# Altium project BLDC Motor Controller.PrjPcb
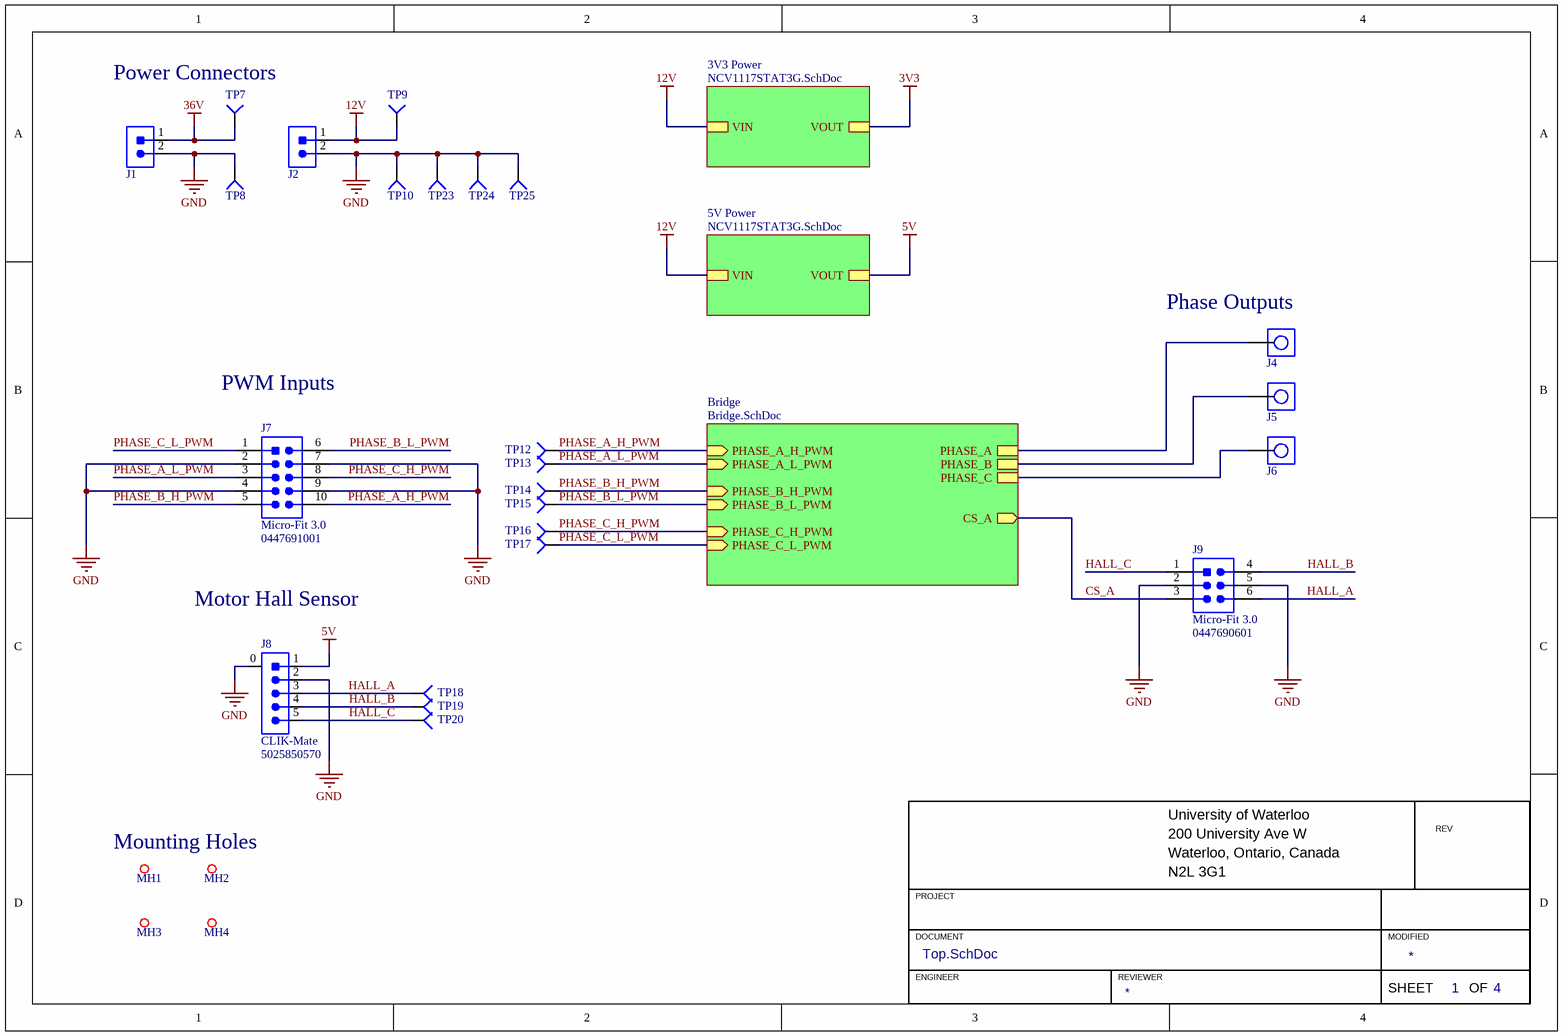
[diagram p0: Top.SchDoc]
4 sheets, 80 parts. Net scope: hierarchical (ports join the sheet entries above them; power ports are global).
Board file: BLDC Motor Controller.PcbDoc
Sheets:
  Top.SchDoc
    Bridge = Bridge.SchDoc
      Phase A CS = INA190.SchDoc
    3V3 Power = NCV1117STAT3G.SchDoc
    5V Power = NCV1117STAT3G.SchDoc

## Sheet Top.SchDoc
size A4; Organization: TESLA Motors, INC; Address1: 3500 Deer Creek Road; Address2: Palo Alto, CA; Address4: U.S.A.; SheetNumber: 1; SheetTotal: 4

### Parts
J1  CON_2POS_XT90  [XT90]  (value not drawn)
J2  CON_2POS_XT60  [XT60]  (value not drawn)
J4  CT3151SP-4  [CALTEST_BANANA_JACK_YELLOW]  (value not drawn)
J5  CT3151SP-5  [CALTEST_BANANA_JACK_GREEN]  (value not drawn)
J6  CT3151SP-6  [CALTEST_BANANA_JACK_BLUE]  (value not drawn)
J7  Family: Micro-Fit 3.0  [MOLEX-0447691001]  (hidden comment: 0447691001)
J8  Family: CLIK-Mate  Manufacturer Part Number 1: 5025850570  [MOLEX-5025850570]  (hidden comment: CON_5M_SM_RA)
J9  Family: Micro-Fit 3.0  [MOLEX-0447690601]  (hidden comment: 0447690601)
MH1  MOUNTING_HOLE_M3  [MOUNTING_HOLE_3mm]  (value not drawn)  (no BOM)
MH2  MOUNTING_HOLE_M3  [MOUNTING_HOLE_3mm]  (value not drawn)  (no BOM)
MH3  MOUNTING_HOLE_M3  [MOUNTING_HOLE_3mm]  (value not drawn)  (no BOM)
MH4  MOUNTING_HOLE_M3  [MOUNTING_HOLE_3mm]  (value not drawn)  (no BOM)
TP7  TESTPOINT_SMD_LOOP  [S1751-46R]  (value not drawn)
TP8  TESTPOINT_SMD_LOOP  [S1751-46R]  (value not drawn)
TP9  TESTPOINT_SMD_LOOP  [S1751-46R]  (value not drawn)
TP10  TESTPOINT_SMD_LOOP  [S1751-46R]  (value not drawn)
TP12  TESTPOINT_1MM_CIRCLE  [TESTPOINT_CIRCLE_1MM]  (value not drawn)  (no BOM)
TP13  TESTPOINT_1MM_CIRCLE  [TESTPOINT_CIRCLE_1MM]  (value not drawn)  (no BOM)
TP14  TESTPOINT_1MM_CIRCLE  [TESTPOINT_CIRCLE_1MM]  (value not drawn)  (no BOM)
TP15  TESTPOINT_1MM_CIRCLE  [TESTPOINT_CIRCLE_1MM]  (value not drawn)  (no BOM)
TP16  TESTPOINT_1MM_CIRCLE  [TESTPOINT_CIRCLE_1MM]  (value not drawn)  (no BOM)
TP17  TESTPOINT_1MM_CIRCLE  [TESTPOINT_CIRCLE_1MM]  (value not drawn)  (no BOM)
TP18  TESTPOINT_1MM_CIRCLE  [TESTPOINT_CIRCLE_1MM]  (value not drawn)  (no BOM)
TP19  TESTPOINT_1MM_CIRCLE  [TESTPOINT_CIRCLE_1MM]  (value not drawn)  (no BOM)
TP20  TESTPOINT_1MM_CIRCLE  [TESTPOINT_CIRCLE_1MM]  (value not drawn)  (no BOM)
TP23  TESTPOINT_SMD_LOOP  [S1751-46R]  (value not drawn)
TP24  TESTPOINT_SMD_LOOP  [S1751-46R]  (value not drawn)
TP25  TESTPOINT_SMD_LOOP  [S1751-46R]  (value not drawn)

### Sub-sheets
3V3 Power = NCV1117STAT3G.SchDoc: VIN, VOUT
5V Power = NCV1117STAT3G.SchDoc: VIN, VOUT
Bridge = Bridge.SchDoc: PHASE_A_H_PWM (in), PHASE_A_L_PWM (in), PHASE_B_H_PWM (in), PHASE_B_L_PWM (in), PHASE_C_H_PWM (in), PHASE_C_L_PWM (in), CS_A (out), PHASE_A, PHASE_B, PHASE_C

### Nets
5V: J8.1 ; sheet 5V Power/VOUT
12V: J2.1 TP9.1(=value) ; sheet 3V3 Power/VIN, sheet 5V Power/VIN
36V: J1.1 TP7.1(=value)
GND: J1.2 J2.2 J7.2 J7.4 J7.7 J7.9 J8.0 J8.2 J9.2 J9.5 TP8.1(=value) TP10.1(=value) TP23.1(=value) TP24.1(=value) TP25.1(=value)
CS_A: J9.3 ; sheet Bridge/CS_A
HALL_A: J8.3 J9.6 TP18.1(=value)
HALL_B: J8.4 J9.4 TP19.1(=value)
HALL_C: J8.5 J9.1 TP20.1(=value)
PHASE_A: J4.1 ; sheet Bridge/PHASE_A
PHASE_A_H_PWM: J7.10 TP12.1(=value) ; sheet Bridge/PHASE_A_H_PWM
PHASE_A_L_PWM: J7.3 TP13.1(=value) ; sheet Bridge/PHASE_A_L_PWM
PHASE_B: J5.1 ; sheet Bridge/PHASE_B
PHASE_B_H_PWM: J7.5 TP14.1(=value) ; sheet Bridge/PHASE_B_H_PWM
PHASE_B_L_PWM: J7.6 TP15.1(=value) ; sheet Bridge/PHASE_B_L_PWM
PHASE_C: J6.1 ; sheet Bridge/PHASE_C
PHASE_C_H_PWM: J7.8 TP16.1(=value) ; sheet Bridge/PHASE_C_H_PWM
PHASE_C_L_PWM: J7.1 TP17.1(=value) ; sheet Bridge/PHASE_C_L_PWM

### Notes on the sheet
- (near TP7) Power Connectors
- (near J4) Phase Outputs
- PWM Inputs
- Motor Hall Sensor
- Mounting Holes
- University of Waterloo
- 200 University Ave W
- REV
- PROJECT
- Waterloo, Ontario, Canada
- N2L 3G1
- DOCUMENT
- ENGINEER
- REVIEWER
- MODIFIED
- SHEET
- OF

### Library data of the parts
J1 = CON_2POS_XT90: XT60 CONNECTORS MALE/FEMALE PAIR; Manufacturer 1: DFRobot; Manufacturer Part Number 1: FIT0588; Mounting Type: TH; Package/Footprint: XT90; Supplier 1: Digi-Key; Supplier Part Number 1: 1738-1438-ND
J2 = CON_2POS_XT60: XT60 CONNECTORS MALE/FEMALE PAIR; Manufacturer 1: SparkFun Electronics; Manufacturer Part Number 1: PRT-10474; Mounting Type: TH; Package/Footprint: XT60; Supplier 1: Digi-Key; Supplier Part Number 1: 1568-1816-ND
J4 = CON_BANANA_YELLOW_25A: CONN BANANA JACK SOLDER YELLOW; Manufacturer 1: Cal Test Electronics; Current Rating: 25A; Manufacturer Part Number 1: CT3151SP-4; Supplier 1: Digi-Key; Supplier Part Number 1: BKCT3151SP-4-ND
J5 = CON_BANANA_GREEN_25A: CONN BANANA JACK SOLDER GREEN; Manufacturer 1: Cal Test Electronics; Current Rating: 25A; Manufacturer Part Number 1: CT3151SP-5; Supplier 1: Digi-Key; Supplier Part Number 1: BKCT3151SP-5-ND
J6 = CON_BANANA_BLUE_25A: CONN BANANA JACK SOLDER BLUE; Manufacturer 1: Cal Test Electronics; Current Rating: 25A; Manufacturer Part Number 1: CT3151SP-6; Supplier 1: Digi-Key; Supplier Part Number 1: BKCT3151SP-6-ND
J7 = CON_MOLEX-RCPT_5x2_TH: CONN RCPT 10POS 0.118 TIN PCB; Manufacturer 1: Molex; Voltage Rating: 250VAC; Current Rating: 5A; Pitch: 3mm; Supplier 1: Digi-Key; Supplier Part Number 1: WM1956-ND; Manufacturer Part Number 1: 0447691001
J8 = CON_5M_SM_RA: CONN HEADER SMD RIGHT ANGLE 1.5MM PITCH; Manufacturer 1: Molex; Current Rating: 2A; Supplier 1: Digi-Key; Mounting Type: SMD; Orientation: Right Angle; Supplier Part Number 1: WM14469CT-ND; Package/Footprint: SMD
J9 = CON_MOLEX-RCPT_3x2_TH: CONN RCPT 6POS 0.118 TIN PCB; Manufacturer 1: Molex; Voltage Rating: 250VAC; Current Rating: 5A; Pitch: 3mm; Supplier 1: Digi-Key; Supplier Part Number 1: 23-0447690601-ND; Manufacturer Part Number 1: 0447690601
TP7-TP10 TP23-TP25 = TESTPOINT_SMD_LOOP: TESTPOINT SMD LOOP; Manufacturer 1: Harwin; Supplier 1: Digi-Key; Manufacturer Part Number 1: S1751-46R; Mounting Type: SMD; Package/Footprint: SMD; Supplier Part Number 1: 952-1478-1-ND
TP12-TP20 = TESTPOINT_1MM_CIRCLE: TESTPOINT 1MM CIRCLE

## Sheet Bridge.SchDoc
size A4; SheetNumber: 2; SheetTotal: 4
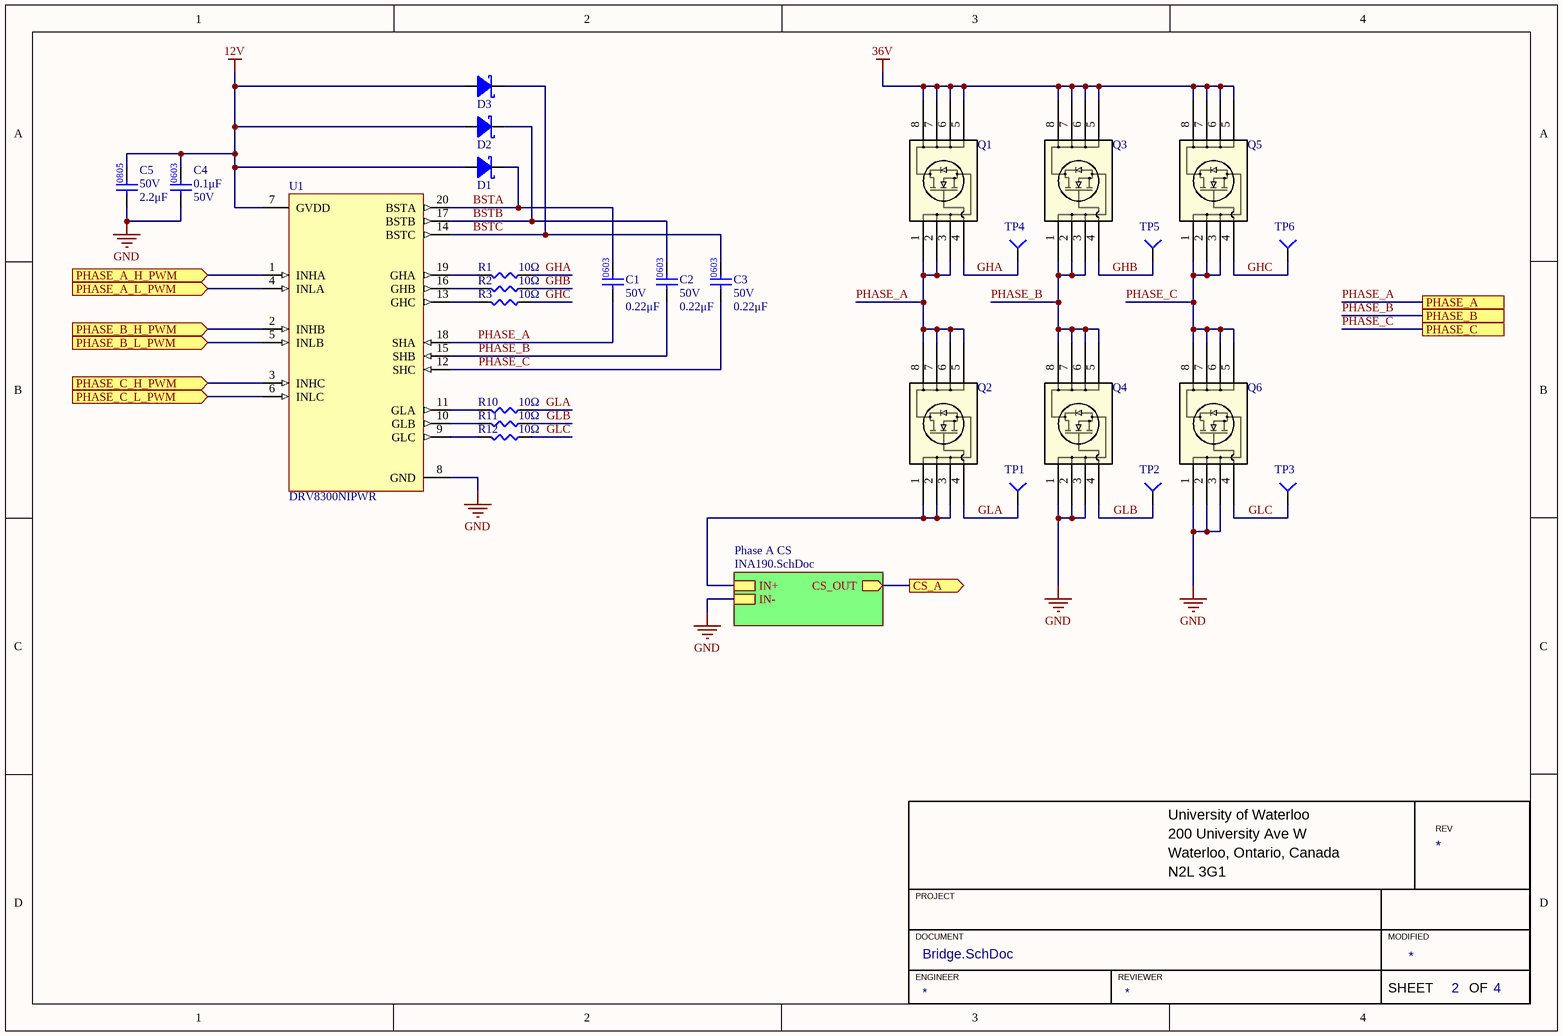
[diagram p1: Bridge.SchDoc]

### Parts
C1  value 0.22μF  Voltage Rating: 50V  [CAP0603]  (hidden comment: CAP_0.22uF_50V_0603)
C2  value 0.22μF  Voltage Rating: 50V  [CAP0603]  (hidden comment: CAP_0.22uF_50V_0603)
C3  value 0.22μF  Voltage Rating: 50V  [CAP0603]  (hidden comment: CAP_0.22uF_50V_0603)
C4  value 0.1μF  Voltage Rating: 50V  [CAP0603]  (hidden comment: CAP_0.1uF_50V_0603)
C5  value 2.2μF  Voltage Rating: 50V  [CAP0805]  (hidden comment: CAP_2.2uF_50V_0805)
D1  DIO_SCHOTTKY_60V_2A  [SOD-123_FLAT]  (value not drawn)
D2  DIO_SCHOTTKY_60V_2A  [SOD-123_FLAT]  (value not drawn)
D3  DIO_SCHOTTKY_60V_2A  [SOD-123_FLAT]  (value not drawn)
Q1  CSD19502Q5B  [DFN5060]  (value not drawn)
Q2  CSD19502Q5B  [DFN5060]  (value not drawn)
Q3  CSD19502Q5B  [DFN5060]  (value not drawn)
Q4  CSD19502Q5B  [DFN5060]  (value not drawn)
Q5  CSD19502Q5B  [DFN5060]  (value not drawn)
Q6  CSD19502Q5B  [DFN5060]  (value not drawn)
R1  value 10Ω  [RES0805]  (hidden comment: RES_10Ω_0805_1%)
R2  value 10Ω  [RES0805]  (hidden comment: RES_10Ω_0805_1%)
R3  value 10Ω  [RES0805]  (hidden comment: RES_10Ω_0805_1%)
R10  value 10Ω  [RES0805]  (hidden comment: RES_10Ω_0805_1%)
R11  value 10Ω  [RES0805]  (hidden comment: RES_10Ω_0805_1%)
R12  value 10Ω  [RES0805]  (hidden comment: RES_10Ω_0805_1%)
TP1  TESTPOINT_1MM_CIRCLE  [TESTPOINT_CIRCLE_1MM]  (value not drawn)  (no BOM)
TP2  TESTPOINT_1MM_CIRCLE  [TESTPOINT_CIRCLE_1MM]  (value not drawn)  (no BOM)
TP3  TESTPOINT_1MM_CIRCLE  [TESTPOINT_CIRCLE_1MM]  (value not drawn)  (no BOM)
TP4  TESTPOINT_1MM_CIRCLE  [TESTPOINT_CIRCLE_1MM]  (value not drawn)  (no BOM)
TP5  TESTPOINT_1MM_CIRCLE  [TESTPOINT_CIRCLE_1MM]  (value not drawn)  (no BOM)
TP6  TESTPOINT_1MM_CIRCLE  [TESTPOINT_CIRCLE_1MM]  (value not drawn)  (no BOM)
U1  DRV8300NIPWR  [20-TSSOP_4400X6500X1200]

### Sub-sheets
Phase A CS = INA190.SchDoc: IN+, IN-, CS_OUT (out)

### Ports
CS_A (out, see Top[3C]), PHASE_A (see Top[3B]), PHASE_A_H_PWM (in, see Top[2B]), PHASE_A_L_PWM (in, see Top[2B]), PHASE_B (see Top[3B]), PHASE_B_H_PWM (in, see Top[2B]), PHASE_B_L_PWM (in, see Top[2B]), PHASE_C (see Top[3B]), PHASE_C_H_PWM (in, see Top[2C]), PHASE_C_L_PWM (in, see Top[2C])

### Nets
12V: C4.2 C5.2 D1.2(Anode) D2.2(Anode) D3.2(Anode) U1.7(GVDD)
36V: Q1.5(D) Q1.6(D) Q1.7(D) Q1.8(D) Q3.5(D) Q3.6(D) Q3.7(D) Q3.8(D) Q5.5(D) Q5.6(D) Q5.7(D) Q5.8(D)
GND: C4.1 C5.1 Q4.1(S) Q4.2(S) Q4.3(S) Q6.1(S) Q6.2(S) Q6.3(S) U1.8(GND) ; sheet Phase A CS/IN-
BSTA: C1.2 D1.1(Cathode) U1.20(BSTA)
BSTB: C2.2 D2.1(Cathode) U1.17(BSTB)
BSTC: C3.2 D3.1(Cathode) U1.14(BSTC)
CS_A: port CS_A, sheet Phase A CS/CS_OUT
GHA: Q1.4(G) R1.2 TP4.1(=value)
GHB: Q3.4(G) R2.2 TP5.1(=value)
GHC: Q5.4(G) R3.2 TP6.1(=value)
GLA: Q2.4(G) R10.2 TP1.1(=value)
GLB: Q4.4(G) R11.2 TP2.1(=value)
GLC: Q6.4(G) R12.2 TP3.1(=value)
PHASE_A: C1.1 Q1.1(S) Q1.2(S) Q1.3(S) Q2.5(D) Q2.6(D) Q2.7(D) Q2.8(D) U1.18(SHA) ; port PHASE_A
PHASE_A_H_PWM: U1.1(INHA) ; port PHASE_A_H_PWM
PHASE_A_L_PWM: U1.4(INLA) ; port PHASE_A_L_PWM
PHASE_B: C2.1 Q3.1(S) Q3.2(S) Q3.3(S) Q4.5(D) Q4.6(D) Q4.7(D) Q4.8(D) U1.15(SHB) ; port PHASE_B
PHASE_B_H_PWM: U1.2(INHB) ; port PHASE_B_H_PWM
PHASE_B_L_PWM: U1.5(INLB) ; port PHASE_B_L_PWM
PHASE_C: C3.1 Q5.1(S) Q5.2(S) Q5.3(S) Q6.5(D) Q6.6(D) Q6.7(D) Q6.8(D) U1.12(SHC) ; port PHASE_C
PHASE_C_H_PWM: U1.3(INHC) ; port PHASE_C_H_PWM
PHASE_C_L_PWM: U1.6(INLC) ; port PHASE_C_L_PWM
NetQ2_1: Q2.1(S) Q2.2(S) Q2.3(S) ; sheet Phase A CS/IN+
NetR1_1: R1.1 U1.19(GHA)
NetR2_1: R2.1 U1.16(GHB)
NetR3_1: R3.1 U1.13(GHC)
NetR10_1: R10.1 U1.11(GLA)
NetR11_1: R11.1 U1.10(GLB)
NetR12_1: R12.1 U1.9(GLC)

### Notes on the sheet
- University of Waterloo
- 200 University Ave W
- REV
- PROJECT
- Waterloo, Ontario, Canada
- N2L 3G1
- DOCUMENT
- ENGINEER
- REVIEWER
- MODIFIED
- SHEET
- OF

### Library data of the parts
C1-C3 = CAP_0.22uF_50V_0603: CAP CER 0.22UF 50V X7R 0603; Manufacturer Part Number 1: UMK107B7224KA-TR; Manufacturer 1: Taiyo Yuden; Mounting Type: SMD; Package: 0603; Dielectric: X7R; Supplier 1: Digi-Key; Supplier Part Number 1: 587-5958-1-ND; LCSC Part #: C5378
C4 = CAP_0.1uF_50V_0603: CAP CER 0.1UF 50V X7R 0603; Manufacturer 1: Yageo; Manufacturer Part Number 1: CC0603KRX7R9BB104; Package/Footprint: 0603; Mounting Type: SMD; Supplier 1: Digi-Key; Supplier Part Number 1: 311-1344-1-ND; Dielectric: X7R
C5 = CAP_2.2uF_50V_0805: CAP CER 2.2UF 50V X5R 0805; Manufacturer Part Number 1: CL21A225KBFNNNE; Manufacturer 1: Samsung Electro-Mechanics; Mounting Type: SMD; Package: 0805; Supplier 1: Digi-Key; Supplier Part Number 1: 1276-6702-1-ND
D1-D3 = DIO_SCHOTTKY_60V_2A: DIODE SCHOTTKY 40V 520MA SOD323; Manufacturer 1: Diodes Incorporated; Manufacturer Part Number 1: B260S1F-7; Package/Footprint: SOD-123F; Mounting Type: SMD; Supplier 1: Digi-Key; Supplier Part Number 1: B260S1F-7DICT-ND
Q1-Q6 = NMOS_CSD19502Q5B_80V_100A: MOSFET N-CH 80V 100A 8VSON; Manufacturer 1: Texas Instruments; Vgs (Max): ±20V; Package/Footprint: 8-PowerTDFN; Supplier 1: Digi-Key; Supplier Part Number 1: 296-37194-1-ND; Vdss (Max): 80V; Id: 100A; Manufacturer Part Number 1: CSD19502Q5B
R1-R3 R10-R12 = RES_10Ω_0805_1%: RES 10 OHM 1% 1/8W 0805; Manufacturer 1: Yageo; Manufacturer Part Number 1: RC0805FR-0710RL; Supplier Part Number 1: 311-10.0CRCT-ND; Supplier 1: Digi-Key; Mounting Type: SMD; LCSC Part #: C17415; Package: 0805
TP1-TP6 = TESTPOINT_1MM_CIRCLE: TESTPOINT 1MM CIRCLE
U1 = DRV8300NIPWR: 100-V MAX SIMPLE 3-PHASE GATE DR; Manufacturer 1: Texas Instruments; Package/Footprint: 20-TSSOP; Supplier 1: Digi-Key; Supplier Part Number 1: 296-DRV8300NIPWRCT-ND; Manufacturer Part Number 1: DRV8300NIPWR

## Sheet INA190.SchDoc
size A4; SheetNumber: 3; SheetTotal: 4
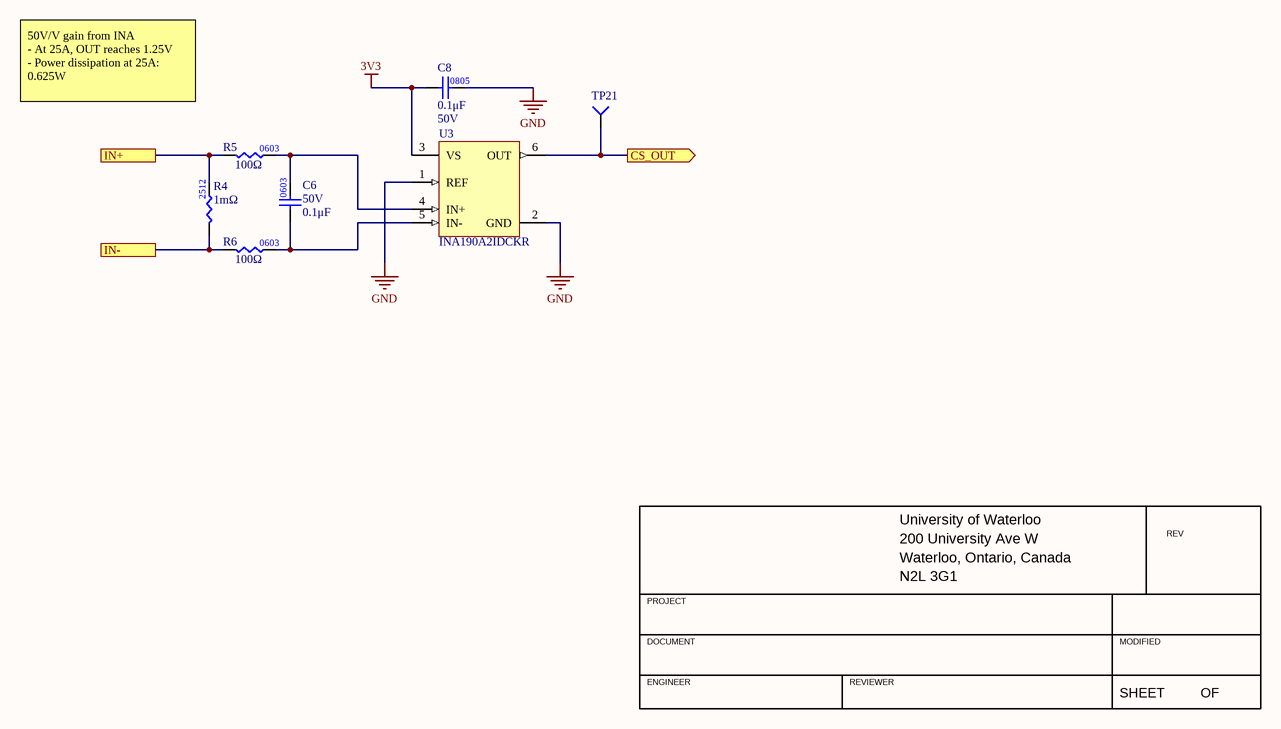
[diagram p2: INA190.SchDoc]

### Parts
C6  value 0.1μF  Voltage Rating: 50V  [CAP0603]  (hidden comment: CAP_0.1uF_50V_0603)
C8  value 0.1μF  Voltage Rating: 50V  [CAP0805]  (hidden comment: CAP_0.1uF_50V_0805)
R4  value 1mΩ  [RESC6532X75N]  (hidden comment: RES_1mΩ_2512_1%)
R5  value 100Ω  [RES0603]  (hidden comment: RES_100Ω_0603_1%)
R6  value 100Ω  [RES0603]  (hidden comment: RES_100Ω_0603_1%)
TP21  TESTPOINT_1MM_CIRCLE  [TESTPOINT_CIRCLE_1MM]  (value not drawn)  (no BOM)
U3  INA190A2IDCKR  [TI_SC-70-6]

### Ports
CS_OUT (out, see Bridge[3C]), IN+ (see Bridge[2C]), IN- (see Bridge[2C])

### Nets
3V3: C8.1 U3.3(VS)
GND: C8.2 R4.1 R6.1 U3.1(REF) U3.2(GND) ; port IN-
CS_A: TP21.1(=value) U3.6(OUT) ; port CS_OUT
NetC6_1: C6.1 R6.2 U3.5(IN-)
NetC6_2: C6.2 R5.2 U3.4(IN+)
NetQ2_1: R4.2 R5.1 ; port IN+

### Notes on the sheet
- 50V/V gain from INA
  - At 25A, OUT reaches 1.25V
  - Power dissipation at 25A: 0.625W
- University of Waterloo
- 200 University Ave W
- REV
- PROJECT
- Waterloo, Ontario, Canada
- N2L 3G1
- DOCUMENT
- ENGINEER
- REVIEWER
- MODIFIED
- SHEET
- OF
- (in symbol RES_100Ω_0603_1%) 0603

### Library data of the parts
C6 = CAP_0.1uF_50V_0603: CAP CER 0.1UF 50V X7R 0603; Manufacturer Part Number 1: CC0603KRX7R9BB104; Manufacturer 1: Yageo; Package/Footprint: 0603; Supplier Part Number 1: 311-1344-1-ND; Supplier 1: Digi-Key; Mounting Type: SMD; Dielectric: X7R
C8 = CAP_0.1uF_50V_0805: CAP CER 0.1UF 50V X7R 0805; Manufacturer 1: Murata Electronics; Manufacturer Part Number 1: GCM21BR71H104KA37K; Package/Footprint: 0805; Supplier 1: Digi-Key; Supplier Part Number 1: 490-8049-1-ND; Mounting Type: SMD; Dielectric: X7R; LCSC Part #: C49678
R4 = RES_1mΩ_2512_1%: RES 1 mOHM 1% 3W 2512; Manufacturer 1: Riedon; Manufacturer Part Number 1: CSRL3-0R001F8; Supplier 1: Digi-Key; Supplier Part Number 1: 696-1834-1-ND; Mounting Type: SMD; Package: 2512
R5 R6 = RES_100Ω_0603_1%: RES 100 OHM 1% 1/10W 0603; Manufacturer 1: Yageo; Manufacturer Part Number 1: RC0603FR-07100RL; Supplier Part Number 1: 311-100HRCT-ND; Supplier 1: Digi-Key
TP21 = TESTPOINT_1MM_CIRCLE: TESTPOINT 1MM CIRCLE
U3 = INA190A2IDCKR: IC CURR SENSE 1 CIRCUIT SC70-6; Manufacturer 1: Texas Instruments; Package/Footprint: 6-TSSOP; Supplier 1: Digi-Key; Supplier Part Number 1: 296-INA190A2IDCKRCT-ND; Manufacturer Part Number 1: INA190A2IDCKR

## Sheet NCV1117STAT3G.SchDoc
size A4; SheetNumber: 4; SheetTotal: 4
Used 2 times, as channels 3V3 Power, 5V Power. Parts and nets are listed once, with the designators drawn on the sheet.
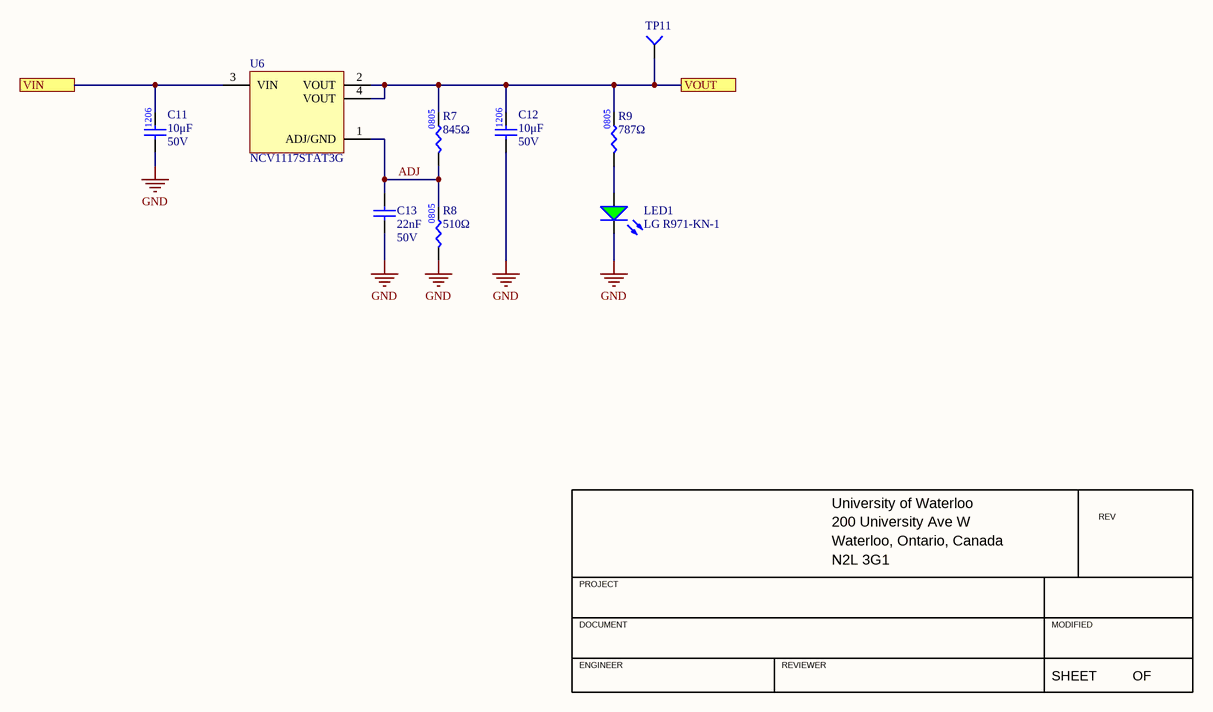
[diagram p3: NCV1117STAT3G.SchDoc]

### Parts
C11  value 10μF  Voltage Rating: 50V  [CAP1206]  (hidden comment: CAP_10uF_50V_1206)
C12  value 10μF  Voltage Rating: 50V  [CAP1206]  (hidden comment: CAP_10uF_50V_1206)
C13  value 22nF  Voltage Rating: 50V  [CAP0805]  (hidden comment: CAP_0.022uF_50V_0805)
LED1  Manufacturer Part Number 1: LG R971-KN-1  [LED_0805_GREEN]  (hidden comment: LED_GREEN)
R7  value 845Ω  [RES0805]  (hidden comment: RES_845Ω_0805_1%)
R8  value 510Ω  [RES0805]  (hidden comment: RES_510Ω_0805_1%)
R9  value 787Ω  [RES0805]  (hidden comment: RES_787Ω_0805_1%)
TP11  TESTPOINT_SMD_LOOP  [S1751-46R]  (value not drawn)
U6  Manufacturer Part Number 1: NCV1117STAT3G  [SOT223]  (hidden comment: LDO_ADJ_1A)

### Ports
VIN (see Top[2A]), VOUT (see Top[3A])

### Nets
GND: C11.1 C12.1 C13.1 LED1.2(K) R8.1
ADJ: C13.2 R7.1 R8.2 U6.1(ADJ/GND)
VIN: C11.2 U6.3(VIN) ; port VIN
VOUT: C12.2 R7.2 R9.2 TP11.1(=value) U6.2(VOUT) U6.4(VOUT) ; port VOUT
NetLED1_1: LED1.1(A) R9.1

### Channels
3V3 Power: designators end in A; ports VIN=12V VOUT=3V3
5V Power: designators end in B; ports VIN=12V VOUT=5V

### Notes on the sheet
- University of Waterloo
- 200 University Ave W
- REV
- PROJECT
- Waterloo, Ontario, Canada
- N2L 3G1
- DOCUMENT
- ENGINEER
- REVIEWER
- MODIFIED
- SHEET
- OF
- (in symbol RES_510Ω_0805_1%) 0805

### Library data of the parts
C11 C12 = CAP_10uF_50V_1206: CAP CER 10UF 50V X5R 1206; Manufacturer 1: Murata; Manufacturer Part Number 1: GRT31CR61H106KE01L; Supplier Part Number 1: 490-12456-1-ND; Supplier 1: Digi-Key; Mounting Type: SMD; Package: 1206; Dielectric: X5R
C13 = CAP_0.022uF_50V_0805: CAP CER 0.022UF 50V C0G 0805; Manufacturer 1: TDK Corporation; Manufacturer Part Number 1: CGA4J2C0G1H223J125AA; Package/Footprint: 2012; Mounting Type: SMD; Supplier 1: Digi-Key; Supplier Part Number 1: 445-6949-1-ND; LCSC Part #: C1729; Dielectric: C0G
LED1 = LED_GREEN: LED GREEN DIFFUSED 0805 SMD; Manufacturer 1: OSRAM; Forward Voltage Drop: 2.2V; Package/Footprint: 0805; Supplier Part Number 1: 475-1410-1-ND; Supplier 1: Digi-Key; Mounting Type: SMD
R7 = RES_845Ω_0805_1%: RES 845 OHM 1% 1/8W 0805; Manufacturer Part Number 1: RC0805FR-07845RL; Manufacturer 1: YAGEO; Power: 0.125W, 1/8W; Supplier 1: Digi-Key; Supplier Part Number 1: 311-845CRCT-ND; Mounting Type: SMD; Package: 0805; Tolerance: 1%
R8 = RES_510Ω_0805_1%: RES 510 OHM 1% 1/8W 0805; Manufacturer 1: Yageo; Manufacturer Part Number 1: RC0805FR-07510RL; Supplier 1: Digi-Key; Supplier Part Number 1: 311-510CRCT-ND
R9 = RES_787Ω_0805_1%: RES 787 OHM 1% 1/8W 0805; Manufacturer 1: Yageo; Manufacturer Part Number 1: RC0805FR-07787RL; Package/Footprint: 0805; Mounting Type: SMD; Supplier 1: Digi-Key; Supplier Part Number 1: 311-787CRCT-ND
TP11 = TESTPOINT_SMD_LOOP: as TP7 on sheet Top; Supplier 1: Digi-Key; Manufacturer Part Number 1: S1751-46R; Mounting Type: SMD; Package/Footprint: SMD; Supplier Part Number 1: 952-1478-1-ND
U6 = LDO_ADJ_1A: IC REG LINEAR POS ADJ 1A SOT223; Manufacturer 1: onsemi; Input Voltage (Max): 20V; Output Voltage (Min): 1.25V; Voltage Dropout (Max): 1.2V; Package/Footprint: SOT-223; Output Current: 1A; Operating Temperature: -40°C - 85°C; Mounting Type: SMD; Supplier 1: Digi-Key; Supplier Part Number 1: NCV1117STAT3GOSCT-ND

## Nets that join several sheets
3V3: INA190 (C8.1 U3.3), 3V3 Power (6 pins)
5V: Top (J8.1), 5V Power (6 pins)
12V: Top (J2.1 TP9.1), Bridge (6 pins), 3V3 Power (C11A.2 U6A.3), 5V Power (C11B.2 U6B.3)
36V: Top (J1.1 TP7.1), Bridge (12 pins)
GND: Top (15 pins), Bridge (9 pins), INA190 (5 pins), 3V3 Power (5 pins), 5V Power (5 pins)
CS_A: Top (J9.3), INA190 (TP21.1 U3.6)
NetQ2_1: Bridge (Q2.1 Q2.2 Q2.3), INA190 (R4.2 R5.1)
PHASE_A: Top (J4.1), Bridge (9 pins)
PHASE_A_H_PWM: Top (J7.10 TP12.1), Bridge (U1.1)
PHASE_A_L_PWM: Top (J7.3 TP13.1), Bridge (U1.4)
PHASE_B: Top (J5.1), Bridge (9 pins)
PHASE_B_H_PWM: Top (J7.5 TP14.1), Bridge (U1.2)
PHASE_B_L_PWM: Top (J7.6 TP15.1), Bridge (U1.5)
PHASE_C: Top (J6.1), Bridge (9 pins)
PHASE_C_H_PWM: Top (J7.8 TP16.1), Bridge (U1.3)
PHASE_C_L_PWM: Top (J7.1 TP17.1), Bridge (U1.6)

## Assembly variants
BUILD: alternate parts R7B -> RES_1.5kΩ_0805_1%